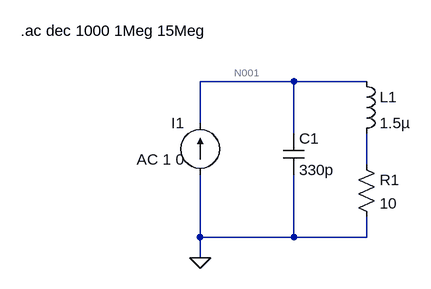
[diagram p0: schematic Aufgabe2.asc]
Aufgabe2.asc, the LTspice schematic file:
Version 4
SHEET 1 880 680
WIRE 208 80 64 80
WIRE 320 80 208 80
WIRE 64 144 64 80
WIRE 208 160 208 80
WIRE 320 208 320 160
WIRE 64 320 64 224
WIRE 208 320 208 224
WIRE 208 320 64 320
WIRE 320 320 320 288
WIRE 320 320 208 320
WIRE 64 352 64 320
FLAG 64 352 0
SYMBOL ind 304 64 R0
SYMATTR InstName L1
SYMATTR Value 1.5µ
SYMBOL res 304 192 R0
SYMATTR InstName R1
SYMATTR Value 10
SYMBOL cap 192 160 R0
SYMATTR InstName C1
SYMATTR Value 330p
SYMBOL current 64 224 R180
WINDOW 0 24 80 Left 2
WINDOW 3 24 52 Left 2
WINDOW 123 24 24 Left 2
WINDOW 39 0 0 Left 0
SYMATTR InstName I1
SYMATTR Value ""
SYMATTR Value2 AC 1 0
TEXT -212 2 Left 2 !.ac dec 1000 1Meg 15Meg

The netlist it stands for:
* Aufgabe2.asc
L1 N001 N002 1.5µ
R1 N002 0 10
C1 N001 0 330p
I1 0 N001 AC 1 0
.ac dec 1000 1Meg 15Meg
.backanno
.end

* Results of the author's LTspice run, read from the files saved beside the schematic
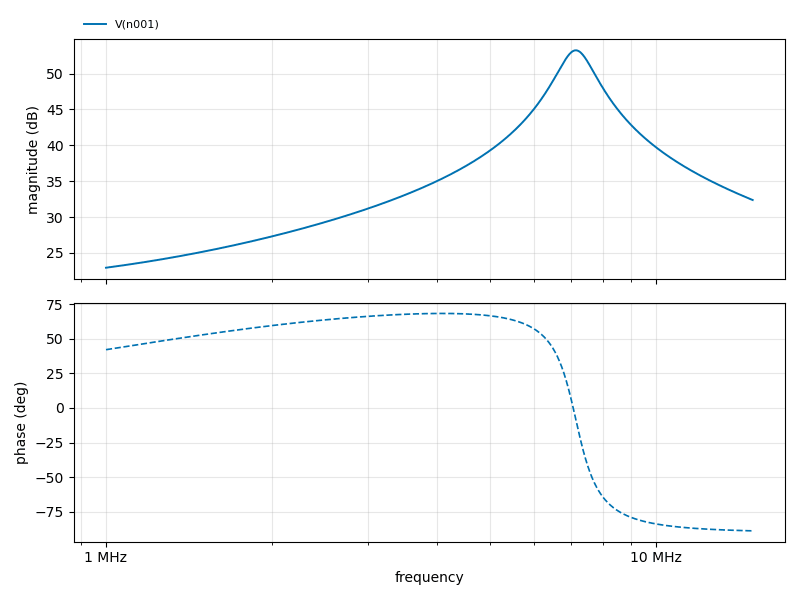
[diagram p1: AC Analysis of Aufgabe2.asc, plotted from the saved traces]
* AC Analysis, 1 run:
*   V(n001): 22.93 dB at 1 MHz, 32.37 dB at 15 MHz, peak 53.24 dB at 7.145 MHz, 3 dB below the peak at 6.641 MHz and 7.702 MHz